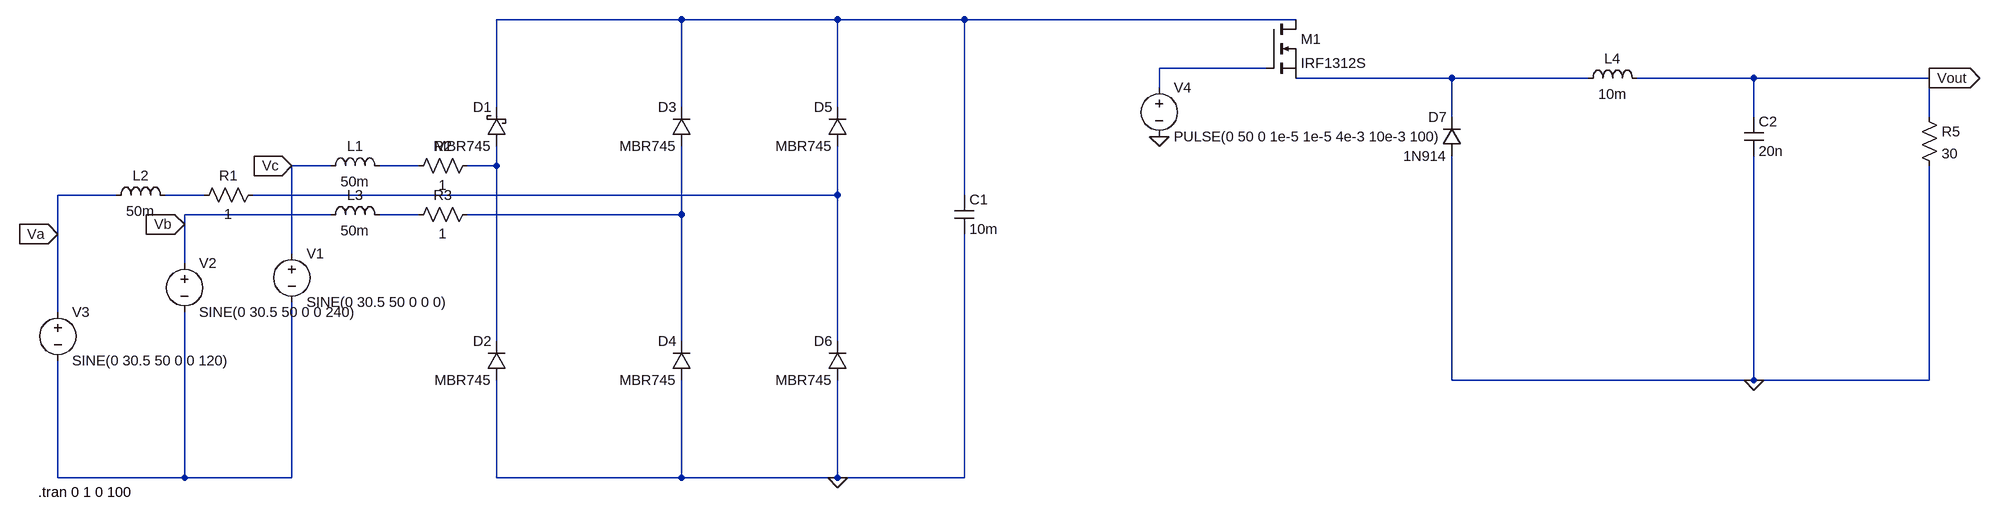
[diagram p0: schematic TopologySchematic.asc]
TopologySchematic.asc, the LTspice schematic file:
Version 4
SHEET 1 2624 680
WIRE 464 -208 160 -208
WIRE 720 -208 464 -208
WIRE 928 -208 720 -208
WIRE 1472 -208 928 -208
WIRE 1424 -128 1248 -128
WIRE 1728 -112 1472 -112
WIRE 1952 -112 1728 -112
WIRE 2224 -112 2032 -112
WIRE 2512 -112 2224 -112
WIRE 1248 -96 1248 -128
WIRE 160 -64 160 -208
WIRE 464 -64 464 -208
WIRE 720 -64 720 -208
WIRE 1728 -48 1728 -112
WIRE 2224 -48 2224 -112
WIRE 2512 -48 2512 -112
WIRE -112 32 -176 32
WIRE 32 32 -32 32
WIRE 160 32 160 0
WIRE 160 32 112 32
WIRE -464 80 -560 80
WIRE -320 80 -384 80
WIRE 720 80 720 0
WIRE 720 80 -240 80
WIRE 928 80 928 -208
WIRE -112 112 -352 112
WIRE 32 112 -32 112
WIRE 464 112 464 0
WIRE 464 112 112 112
WIRE -352 128 -352 112
WIRE -560 144 -560 80
WIRE -176 176 -176 32
WIRE -352 192 -352 128
WIRE -560 272 -560 144
WIRE 160 320 160 32
WIRE 464 320 464 112
WIRE 720 320 720 80
WIRE 1728 384 1728 16
WIRE 2224 384 2224 16
WIRE 2224 384 1728 384
WIRE 2512 384 2512 32
WIRE 2512 384 2224 384
WIRE -560 544 -560 352
WIRE -352 544 -352 272
WIRE -352 544 -560 544
WIRE -176 544 -176 256
WIRE -176 544 -352 544
WIRE 160 544 160 384
WIRE 464 544 464 384
WIRE 464 544 160 544
WIRE 720 544 720 384
WIRE 720 544 464 544
WIRE 928 544 928 144
WIRE 928 544 720 544
FLAG 720 544 0
FLAG 2224 384 0
FLAG 1248 -16 0
FLAG 2512 -112 Vout
IOPIN 2512 -112 Out
FLAG -560 144 Va
IOPIN -560 144 In
FLAG -352 128 Vb
IOPIN -352 128 In
FLAG -176 32 Vc
IOPIN -176 32 In
SYMBOL voltage -176 160 R0
WINDOW 123 0 0 Left 0
WINDOW 39 0 0 Left 0
SYMATTR InstName V1
SYMATTR Value SINE(0 30.5 50 0 0 0)
SYMBOL schottky 176 0 R180
WINDOW 0 24 64 Left 2
WINDOW 3 24 0 Left 2
SYMATTR InstName D1
SYMATTR Value MBR745
SYMATTR Description Diode
SYMATTR Type diode
SYMBOL diode 176 384 R180
WINDOW 0 24 64 Left 2
WINDOW 3 24 0 Left 2
SYMATTR InstName D2
SYMATTR Value MBR745
SYMBOL diode 480 0 R180
WINDOW 0 24 64 Left 2
WINDOW 3 24 0 Left 2
SYMATTR InstName D3
SYMATTR Value MBR745
SYMBOL diode 480 384 R180
WINDOW 0 24 64 Left 2
WINDOW 3 24 0 Left 2
SYMATTR InstName D4
SYMATTR Value MBR745
SYMBOL ind -128 48 R270
WINDOW 0 32 56 VTop 2
WINDOW 3 5 56 VBottom 2
SYMATTR InstName L1
SYMATTR Value 50m
SYMBOL voltage -352 176 R0
WINDOW 123 0 0 Left 0
WINDOW 39 0 0 Left 0
SYMATTR InstName V2
SYMATTR Value SINE(0 30.5 50 0 0 240)
SYMBOL voltage -560 256 R0
WINDOW 123 0 0 Left 0
WINDOW 39 0 0 Left 0
SYMATTR InstName V3
SYMATTR Value SINE(0 30.5 50 0 0 120)
SYMBOL diode 736 0 R180
WINDOW 0 24 64 Left 2
WINDOW 3 24 0 Left 2
SYMATTR InstName D5
SYMATTR Value MBR745
SYMBOL diode 736 384 R180
WINDOW 0 24 64 Left 2
WINDOW 3 24 0 Left 2
SYMATTR InstName D6
SYMATTR Value MBR745
SYMBOL ind -480 96 R270
WINDOW 0 32 56 VTop 2
WINDOW 3 5 56 VBottom 2
SYMATTR InstName L2
SYMATTR Value 50m
SYMBOL ind -128 128 R270
WINDOW 0 32 56 VTop 2
WINDOW 3 5 56 VBottom 2
SYMATTR InstName L3
SYMATTR Value 50m
SYMBOL res -224 64 R90
WINDOW 0 0 56 VBottom 2
WINDOW 3 32 56 VTop 2
SYMATTR InstName R1
SYMATTR Value 1
SYMBOL res 128 16 R90
WINDOW 0 0 56 VBottom 2
WINDOW 3 32 56 VTop 2
SYMATTR InstName R2
SYMATTR Value 1
SYMBOL res 128 96 R90
WINDOW 0 0 56 VBottom 2
WINDOW 3 32 56 VTop 2
SYMATTR InstName R3
SYMATTR Value 1
SYMBOL cap 912 80 R0
SYMATTR InstName C1
SYMATTR Value 10m
SYMBOL diode 1744 16 R180
WINDOW 0 24 64 Left 2
WINDOW 3 24 0 Left 2
SYMATTR InstName D7
SYMATTR Value 1N914
SYMBOL ind 1936 -96 R270
WINDOW 0 32 56 VTop 2
WINDOW 3 5 56 VBottom 2
SYMATTR InstName L4
SYMATTR Value 10m
SYMBOL cap 2208 -48 R0
SYMATTR InstName C2
SYMATTR Value 20n
SYMBOL res 2496 -64 R0
SYMATTR InstName R5
SYMATTR Value 30
SYMBOL voltage 1248 -112 R0
WINDOW 123 0 0 Left 0
WINDOW 39 0 0 Left 0
SYMATTR InstName V4
SYMATTR Value PULSE(0 50 0 1e-5 1e-5 4e-3 10e-3 100)
SYMBOL nmos 1424 -208 R0
SYMATTR InstName M1
SYMATTR Value IRF1312S
TEXT -592 568 Left 2 !.tran 0 1 0 100

The netlist it stands for:
* TopologySchematic.asc
V1 Vc N010 SINE(0 30.5 50 0 0 0)
D1 N005 N001 MBR745
D2 0 N005 MBR745
D3 N009 N001 MBR745
D4 0 N009 MBR745
L1 Vc N004 50m
V2 Vb N010 SINE(0 30.5 50 0 0 240)
V3 Va N010 SINE(0 30.5 50 0 0 120)
D5 N007 N001 MBR745
D6 0 N007 MBR745
L2 Va N006 50m
L3 Vb N008 50m
R1 N007 N006 1
R2 N005 N004 1
R3 N009 N008 1
C1 N001 0 10m
D7 0 N003 1N914
L4 N003 Vout 10m
C2 Vout 0 20n
R5 Vout 0 30
V4 N002 0 PULSE(0 50 0 1e-5 1e-5 4e-3 10e-3 100)
M1 N001 N002 N003 N003 IRF1312S
.model D D
.lib standard.dio
.model NMOS NMOS
.model PMOS PMOS
.lib standard.mos
.tran 0 1 0 100
.backanno
.end